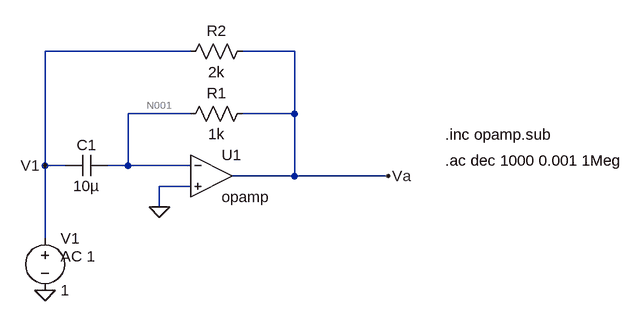
[diagram p0: schematic EJ3a.asc]
EJ3a.asc, the LTspice schematic file:
Version 4
SHEET 1 880 680
WIRE 80 -400 -144 -400
WIRE 240 -400 160 -400
WIRE 80 -304 -16 -304
WIRE 240 -304 240 -400
WIRE 240 -304 160 -304
WIRE -144 -224 -144 -400
WIRE -112 -224 -144 -224
WIRE -16 -224 -16 -304
WIRE -16 -224 -48 -224
WIRE 80 -224 -16 -224
WIRE 240 -208 240 -304
WIRE 240 -208 144 -208
WIRE 384 -208 240 -208
WIRE 80 -192 32 -192
WIRE 32 -160 32 -192
WIRE -144 -112 -144 -224
FLAG 384 -208 Va
FLAG -144 -224 V1
FLAG -144 -32 0
FLAG 32 -160 0
SYMBOL OpAmps\\opamp 112 -272 R0
SYMATTR InstName U1
SYMBOL voltage -144 -128 R0
WINDOW 123 24 44 Left 2
WINDOW 39 0 0 Left 0
SYMATTR Value2 AC 1
SYMATTR InstName V1
SYMATTR Value 1
SYMBOL res 176 -320 R90
WINDOW 0 0 56 VBottom 2
WINDOW 3 32 56 VTop 2
SYMATTR InstName R1
SYMATTR Value 1k
SYMBOL res 176 -416 R90
WINDOW 0 0 56 VBottom 2
WINDOW 3 32 56 VTop 2
SYMATTR InstName R2
SYMATTR Value 2k
SYMBOL cap -48 -240 R90
WINDOW 0 0 32 VBottom 2
WINDOW 3 32 32 VTop 2
SYMATTR InstName C1
SYMATTR Value 10µ
TEXT 472 -272 Left 2 !.inc opamp.sub
TEXT 472 -232 Left 2 !.ac dec 1000 0.001 1Meg

The netlist it stands for:
* EJ3a.asc
XU1 N001 0 Va opamp Aol=100K GBW=10Meg  ; pins invin noninvin out
V1 V1 0 1 AC 1
R1 Va N001 1k
R2 Va V1 2k
C1 N001 V1 10µ
.inc opamp.sub
.ac dec 1000 0.001 1Meg
.backanno
.end

* Results of the author's LTspice run, read from the files saved beside the schematic
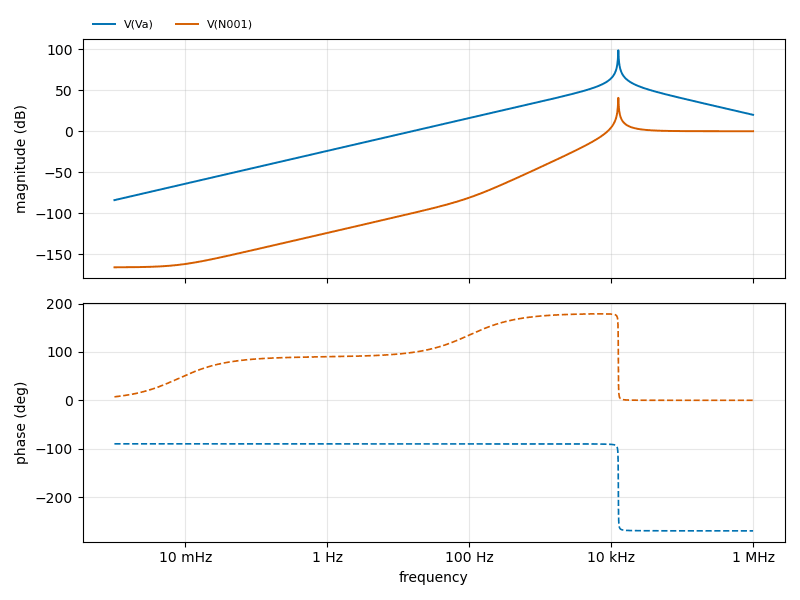
[diagram p1: AC Analysis of EJ3a.asc, plotted from the saved traces]
* AC Analysis, 1 run:
*   V(Va): -84.04 dB at 1 mHz, 20.00 dB at 1 MHz, peak 98.70 dB at 12.62 kHz, 3 dB below the peak at 12.56 kHz and 12.67 kHz
*   V(N001): -165.95 dB at 1 mHz, 0.00 dB at 1 MHz, peak 40.72 dB at 12.62 kHz, 3 dB below the peak at 12.56 kHz and 12.67 kHz